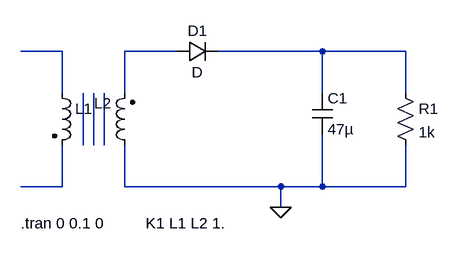
[diagram p0: schematic Transformer.asc]
Transformer.asc, the LTspice schematic file:
Version 4
SHEET 1 880 680
WIRE 48 16 -16 16
WIRE 224 16 144 16
WIRE 448 16 288 16
WIRE 576 16 448 16
WIRE 48 80 48 16
WIRE 144 80 144 16
WIRE 448 80 448 16
WIRE 576 80 576 16
WIRE 80 160 80 80
WIRE 96 160 96 80
WIRE 112 160 112 80
WIRE 48 224 48 160
WIRE 48 224 -16 224
WIRE 144 224 144 160
WIRE 384 224 144 224
WIRE 448 224 448 144
WIRE 448 224 384 224
WIRE 576 224 576 160
WIRE 576 224 448 224
WIRE 384 256 384 224
FLAG 384 256 0
SYMBOL ind2 32 64 R0
SYMATTR InstName L1
SYMATTR Value ""
SYMATTR Type ind
SYMBOL ind2 160 176 R180
WINDOW 0 36 80 Left 2
WINDOW 3 36 40 Left 2
SYMATTR InstName L2
SYMATTR Value ""
SYMATTR Type ind
SYMBOL diode 224 32 R270
WINDOW 0 32 32 VTop 2
WINDOW 3 0 32 VBottom 2
SYMATTR InstName D1
SYMBOL cap 432 80 R0
SYMATTR InstName C1
SYMATTR Value 47µ
SYMBOL res 560 64 R0
SYMATTR InstName R1
SYMATTR Value 1k
TEXT -16 280 Left 2 !.tran 0 0.1 0
TEXT 176 280 Left 2 !K1 L1 L2 1.

The netlist it stands for:
* Transformer.asc
L1 N001 N007
L2 0 N002
D1 N002 N003 D
C1 N003 0 47µ
R1 N003 0 1k
.model D D
.lib standard.dio
.tran 0 0.1 0
K1 L1 L2 1.
.backanno
.end